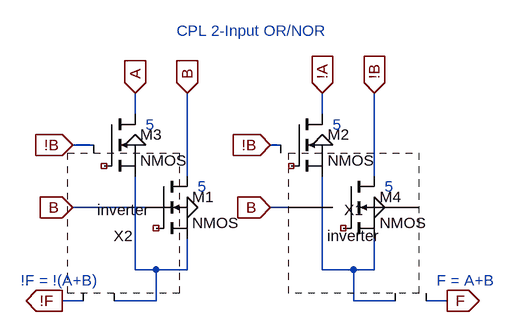
[diagram p0: schematic cpl_or.asc]
cpl_or.asc, the LTspice schematic file:
Version 4
SHEET 1 1292 680
WIRE -1328 -112 -1328 -144
WIRE -1040 -112 -1040 -144
WIRE -1392 -64 -1424 -64
WIRE -1104 -64 -1120 -64
WIRE -1248 -16 -1248 -144
WIRE -960 -16 -960 -144
WIRE -1312 32 -1424 32
WIRE -1024 32 -1120 32
WIRE -1328 128 -1328 -16
WIRE -1296 128 -1328 128
WIRE -1248 128 -1248 80
WIRE -1248 128 -1296 128
WIRE -1040 128 -1040 -16
WIRE -992 128 -1040 128
WIRE -960 128 -960 80
WIRE -960 128 -992 128
WIRE -1408 176 -1440 176
WIRE -1296 176 -1296 128
WIRE -1296 176 -1360 176
WIRE -992 176 -992 128
WIRE -928 176 -992 176
WIRE -848 176 -880 176
FLAG -1424 -64 !B
IOPIN -1424 -64 In
FLAG -1424 32 B
IOPIN -1424 32 In
FLAG -1328 -144 A
IOPIN -1328 -144 In
FLAG -1248 -144 B
IOPIN -1248 -144 In
FLAG -1328 -64 0
FLAG -1040 -144 !A
IOPIN -1040 -144 In
FLAG -960 -144 !B
IOPIN -960 -144 In
FLAG -1120 -64 !B
IOPIN -1120 -64 In
FLAG -1120 32 B
IOPIN -1120 32 In
FLAG -848 176 F
IOPIN -848 176 Out
FLAG -1440 176 !F
IOPIN -1440 176 Out
FLAG -1248 32 0
FLAG -1040 -64 0
FLAG -960 32 0
SYMBOL nmos -1376 -112 R0
SYMATTR InstName M3
SYMATTR Value2 l=0.6u w=1.5u
SYMATTR SpiceModel ""
SYMATTR Value NMOS
SYMBOL inverter -912 176 R0
SYMATTR InstName X1
SYMBOL inverter -1376 176 R180
SYMATTR InstName X2
SYMBOL nmos -1296 -16 R0
SYMATTR InstName M1
SYMATTR Value2 l=0.6u w=1.5u
SYMATTR SpiceModel ""
SYMATTR Value NMOS
SYMBOL nmos -1088 -112 R0
SYMATTR InstName M2
SYMATTR Value2 l=0.6u w=1.5u
SYMATTR SpiceModel ""
SYMATTR Value NMOS
SYMBOL nmos -1008 -16 R0
SYMATTR InstName M4
SYMATTR Value2 l=0.6u w=1.5u
SYMATTR SpiceModel ""
SYMATTR Value NMOS
TEXT -1264 -240 Left 0 ;CPL 2-Input OR/NOR
TEXT -864 144 Left 0 ;F = A+B
TEXT -1504 144 Left 0 ;!F = !(A+B)
TEXT -1312 -96 Left 0 ;5
TEXT -1232 0 Left 0 ;5
TEXT -1024 -96 Left 0 ;5
TEXT -944 0 Left 0 ;5

The netlist it stands for:
* cpl_or.asc
M3 A NC_01 N001 N001 NMOS l=0.6u w=1.5u
* X1: inverter (symbol inverter not available, pin order unknown); nets seen at it: !B, 0, B, F, N002
* X2: inverter (symbol inverter not available, pin order unknown); nets seen at it: !B, !F, 0, B, N001
M1 B NC_02 N001 N001 NMOS l=0.6u w=1.5u
M2 !A NC_03 N002 N002 NMOS l=0.6u w=1.5u
M4 !B NC_04 N002 N002 NMOS l=0.6u w=1.5u
.model NMOS NMOS
.model PMOS PMOS
.lib standard.mos
* CPL 2-Input OR/NOR
* F = A+B
* !F = !(A+B)
* 5
* 5
* 5
* 5
.backanno
.end